# Altium schematic sheet VEHICLE_RAW_SCH.SchDoc
size A4; SheetNumber: 2; SheetTotal: 3
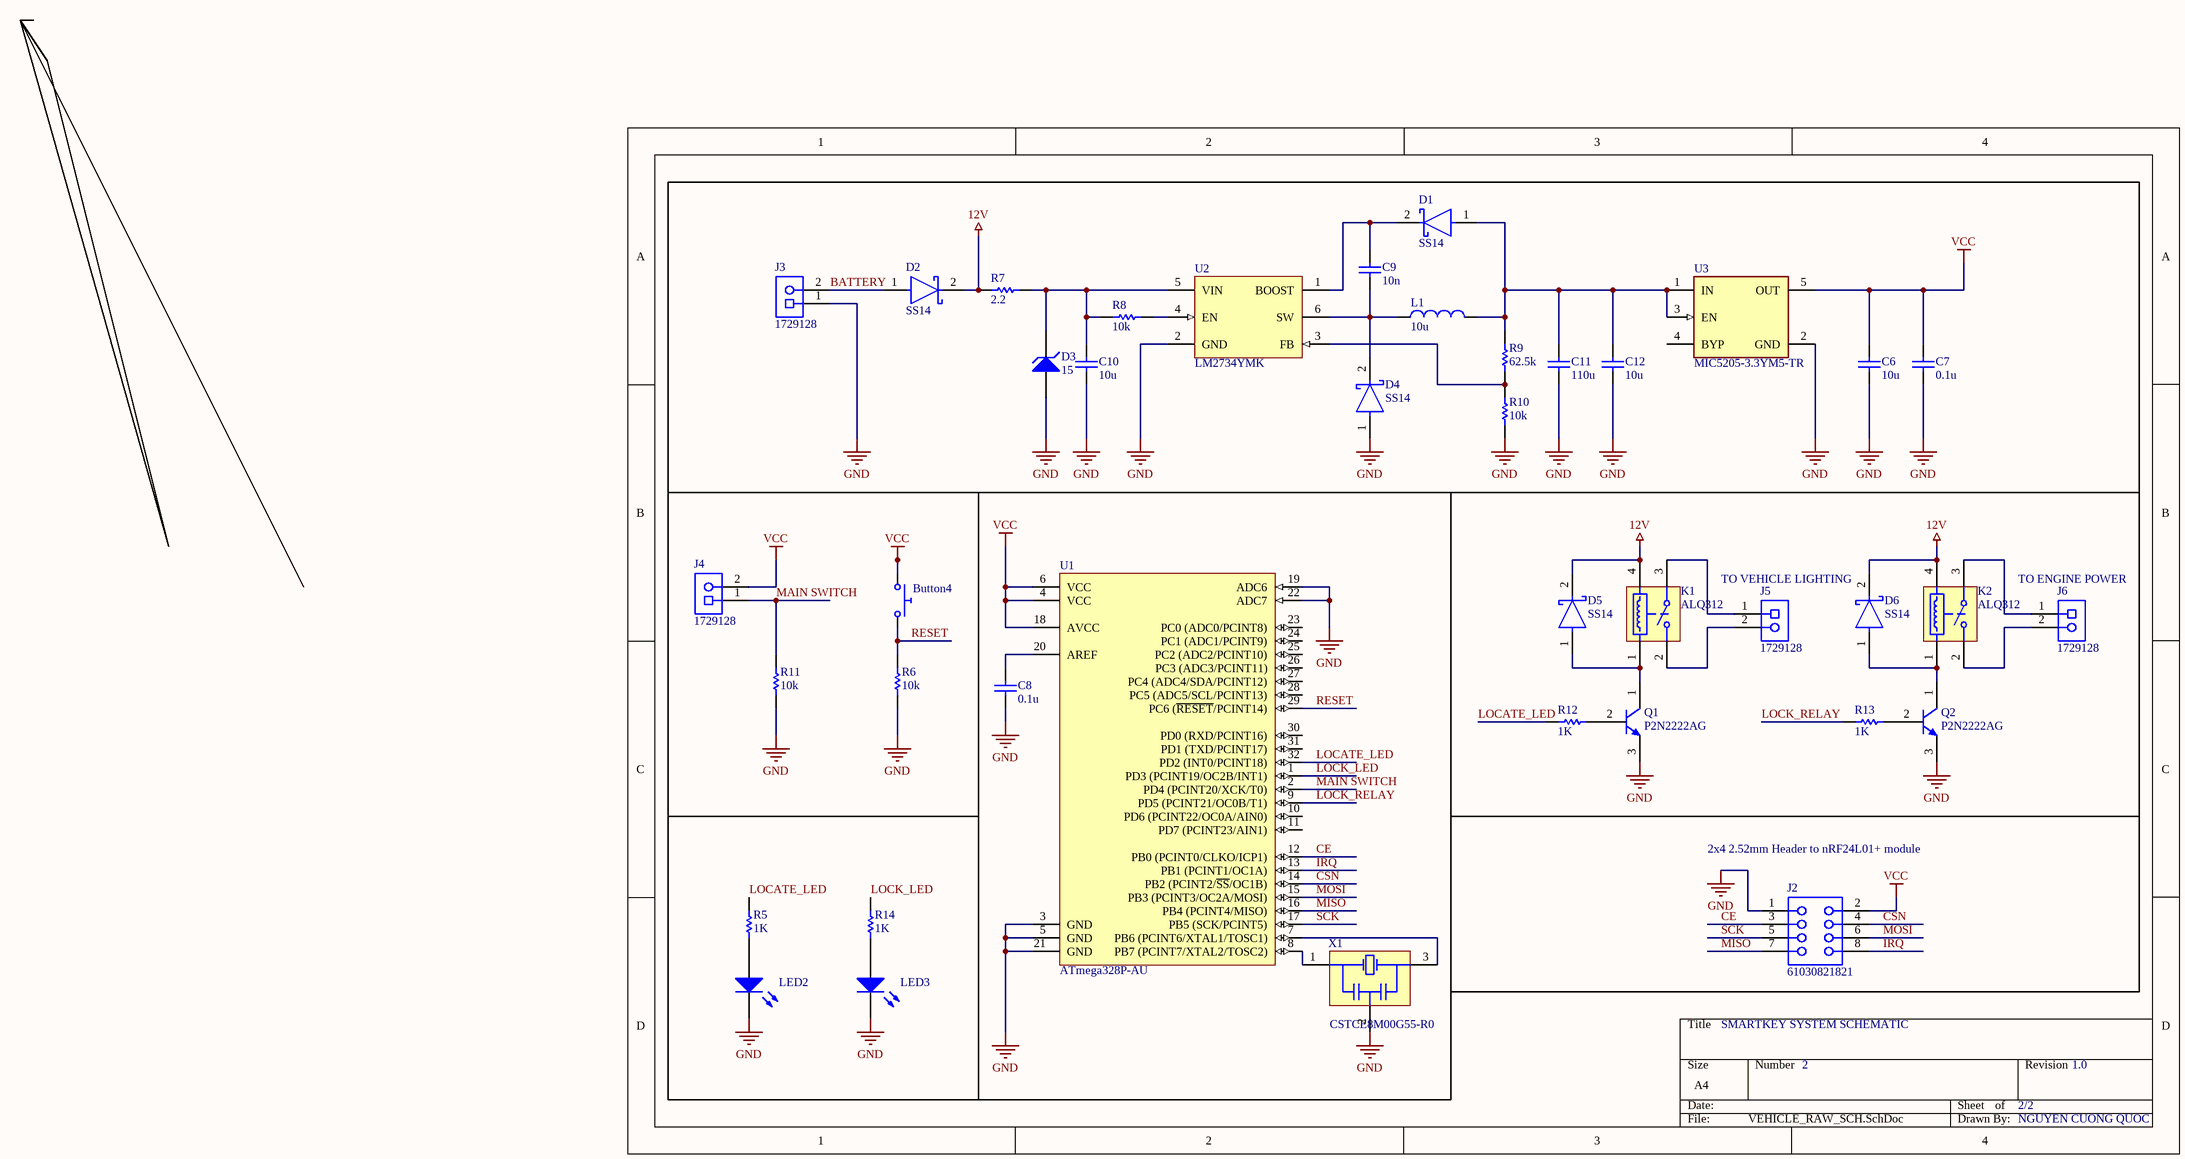
[diagram p0: VEHICLE_RAW_SCH.SchDoc]

## Parts
Button4  Push Button Normally Opened  (value not drawn)
C6  value 10u  (hidden comment: Capacitor)
C7  value 0.1u  (hidden comment: Capacitor)
C8  value 0.1u  (hidden comment: Capacitor)
C9  value 10n  (hidden comment: Capacitor)
C10  value 10u  (hidden comment: Capacitor)
C11  value 110u  (hidden comment: Capacitor)
C12  value 10u  (hidden comment: Capacitor)
D1  SS14  [FP-403AE-MFG]
D2  SS14  [FP-403AE-MFG]
D3  BV: 15  (hidden comment: Zener Diode)
D4  SS14  [FP-403AE-MFG]
D5  SS14  [FP-403AE-MFG]
D6  SS14  [FP-403AE-MFG]
J2  61030821821  [61030821821]
J3  1729128  [PHOE-1729128-2_V]
J4  1729128  [PHOE-1729128-2_V]
J5  1729128  [PHOE-1729128-2_V]
J6  1729128  [PHOE-1729128-2_V]
K1  ALQ312  [PNSC-LQ-4-2000x1000x1600_V]
K2  ALQ312  [PNSC-LQ-4-2000x1000x1600_V]
L1  value 10u  (hidden comment: Inductor)
LED2  Light-Emitting Diode  (value not drawn)
LED3  Light-Emitting Diode  (value not drawn)
Q1  P2N2222AG  [ONSC-TO-92-3-29-11]
Q2  P2N2222AG  [ONSC-TO-92-3-29-11]
R5  value 1K  (hidden comment: Resistor)
R6  value 10k  (hidden comment: Resistor)
R7  value 2.2  (hidden comment: Resistor)
R8  value 10k  (hidden comment: Resistor)
R9  value 62.5k  (hidden comment: Resistor)
R10  value 10k  (hidden comment: Resistor)
R11  value 10k  (hidden comment: Resistor)
R12  value 1K  (hidden comment: Resistor)
R13  value 1K  (hidden comment: Resistor)
R14  value 1K  (hidden comment: Resistor)
U1  ATmega328P-AU  [32A_M]
U2  LM2734YMK  [DDC0006A_M]
U3  MIC5205-3.3YM5-TR  [FP-M5-MFG]
X1  CSTCE8M00G55-R0  [MURA-CSTCE_G_A-3_V]

## Nets
12V: D2.2(C) D5.2(C) D6.2(C) K1.4 K2.4 R7.2
GND: C6.1 C7.1 C8.1 C10.1 C11.1 C12.1 D3.1(A) D4.1(A) J2.1 J3.1 LED2.2(K) LED3.2(K) Q1.3(E) Q2.3(E) R6.1 R10.2 R11.1 U1.3(GND) U1.5(GND) U1.19(ADC6) U1.21(GND) U1.22(ADC7) U2.2(GND) U3.2(GND) X1.2(GND)
VCC: Button4.1 C6.2 C7.2 J2.2 J4.2 U1.4(VCC) U1.6(VCC) U1.18(AVCC) U3.5(OUT)
BATTERY: D2.1(A) J3.2
CE: J2.3 U1.12(PB0_(PCINT0/CLKO/ICP1))
CSN: J2.4 U1.14(PB2_(PCINT2/~{SS}/OC1B))
IRQ: J2.8 U1.13(PB1_(PCINT1/OC1A))
LOCATE_LED: R5.2 R12.2 U1.32(PD2_(INT0/PCINT18))
LOCK_LED: R14.2 U1.1(PD3_(PCINT19/OC2B/INT1))
LOCK_RELAY: R13.2 U1.9(PD5_(PCINT21/OC0B/T1))
MAIN SWITCH: J4.1 R11.2 U1.2(PD4_(PCINT20/XCK/T0))
MISO: J2.7 U1.16(PB4_(PCINT4/MISO))
MOSI: J2.6 U1.15(PB3_(PCINT3/OC2A/MOSI))
RESET: Button4.2 R6.2 U1.29(PC6_(~{RESET}/PCINT14))
SCK: J2.5 U1.17(PB5_(SCK/PCINT5))
NetC8_2: C8.2 U1.20(AREF)
NetC9_1: C9.1 D4.2(C) L1.1 U2.6(SW)
NetC9_2: C9.2 D1.2(C) U2.1(BOOST)
NetC10_2: C10.2 D3.2(K) R7.1 R8.2 U2.5(VIN)
NetC11_2: C11.2 C12.2 D1.1(A) L1.2 R9.1 U3.1(IN) U3.3(EN)
NetD5_1: D5.1(A) K1.1 Q1.1(C)
NetD6_1: D6.1(A) K2.1 Q2.1(C)
NetJ5_1: J5.1 K1.3(COM)
NetJ5_2: J5.2 K1.2(NO)
NetJ6_1: J6.1 K2.3(COM)
NetJ6_2: J6.2 K2.2(NO)
NetLED2_1: LED2.1(A) R5.1
NetLED3_1: LED3.1(A) R14.1
NetQ1_2: Q1.2(B) R12.1
NetQ2_2: Q2.2(B) R13.1
NetR8_1: R8.1 U2.4(EN)
NetR9_2: R9.2 R10.1 U2.3(FB)
NetU1_7: U1.7(PB6_(PCINT6/XTAL1/TOSC1)) X1.3(X2)
NetU1_8: U1.8(PB7_(PCINT7/XTAL2/TOSC2)) X1.1(X1)

Not connected (* = marked no-connect by the designer): U1 10(PD6_(PCINT22/OC0A/AIN0)) 11(PD7_(PCINT23/AIN1)) 23(PC0_(ADC0/PCINT8)) 24(PC1_(ADC1/PCINT9)) 25(PC2_(ADC2/PCINT10)) 26(PC3_(ADC3/PCINT11)) 27(PC4_(ADC4/SDA/PCINT12)) 28(PC5_(ADC5/SCL/PCINT13)) 30(PD0_(RXD/PCINT16)) 31(PD1_(TXD/PCINT17)); U3 4(BYP)

## Notes on the sheet
- TO VEHICLE LIGHTING
- (near J6) TO ENGINE POWER
- 2x4 2.52mm Header to nRF24L01+ module
- SMARTKEY SYSTEM SCHEMATIC
- 2
- 2/2
- 1.0
- NGUYEN CUONG QUOC

## Library data of the parts
Button4 = Push Button NO: closed: 0; Rclosed: 1m; Ropen: 1Meg; SimulationGenericComponent: True
C6-C12 = Capacitor: SimulationGenericComponent: True
D1 D2 D4-D6 = CMP-2000-04943-2: DIODE SCHOTTKY 40V 1A SMA; Manufacturer: ON Semiconductor; Peak Reverse Current: 0.2mA; Max Junction Temp: +125°C; Standoff Height: 0.05mm; Max Surge Forward Current: 40A; Mouser Description: Schottky Diodes & Rectifiers SMA 40V 1.0A; RoHS: TRUE; Lead Free: Yes; Manufacturer Part Number: SS14; Device Class L3: Schottky Diodes; Category: Diode; Automotive: No; Digikey Description: DIODE SCHOTTKY 40V 1A SMA; ComponentLink2Description: Datasheet; Device Class L2: Diodes; Height: 2.5mm; Temperature Range High: +125°C; ComponentLink2URL: https://www.onsemi.com/pub/Collateral/SS19-D.PDF; Device Class L1: Discrete Semiconductors; Package: 403AE; Octopart: https://octopart.com/ss14-on+semiconductor-29205033; Max Repetitive Reverse Voltage: 40V; Temperature Range Low: -65°C; Forward Current: 1A; Temperature: -65°C to +125°C
D3 = Zener Diode: AF: 1; BV_MAX: 1e99; CJO: 0; EG: 1.11; FC: 0.5; IBV: 0.001; IS: 1e-14; MJSW: 0.33; NTUN: 30; TNOM: 27; XTI: 3; SimulationGenericComponent: True; CJP: 0; CTA: 0; CTP: 0; FCS: 0.5; FV_MAX: 1e99; IKF: 0; IKR: 0; ISR: 1e-14; JSW: 0; JTUN: 0; JTUNSW: 0; KEG: 1; KF: 0; LEVEL: 1; N: 1; NBV: 1; NR: 1; NS: 1; PHP: 1; RS: 0; TCV: 0; TLEV: 0; TLEVC: 0; TM1: 0; TM2: 0; TPB: 0; TPHP: 0; TRS: 0; TRS2: 0; TT: 0; TTT1: 0; TTT2: 0; VJ: 1; XTITUN: 3
J2 = CMP-1502-01304-3: NexarPartId: 89205501; Gender: Female; Current Rating: 3A; Operating Supply Voltage: 250V; Contact Resistance: 20mΩ; Orientation: Vertical; RoHS: Non-Compliant; Number of Pins: 8; Packaging: Tape and Reel; Lead Pitch: 2.54mm
J3-J6 = CMP-2000-05815-1: PCB Terminal Block, 13.5 A, 400 V, 2-Pin THD, RoHS, Bulk; Manufacturer: Phoenix Contact; Package Version: 03/2015; No. of Rows: 1; Pitch: 5.08mm; No. of Positions: 2; Voltage Rating: 400V; Current Rating: 13500mA; Manufacturer URL: http://www.phoenixcontact.com/; Datasheet URL: https://datasheet.ciiva.com/16046/1729128-16046181.pdf; RoHS: TRUE; Package URL: https://www.phoenixcontact.com/online/portal/pi/pxc/product_detail_page/!ut/p/b1/3VdJjqNKFDxLH8AFycySyWY2ozFsEPOMMQaDOX1XedGL_1Vdm5YXJleknhSKeBkvI6EA8ncAo3AYoDhBQGco6KN7VURTdemj9us_IEKEZo_YHiPAEWEFmDGOHMORkqKYCORBZxgL7ZoaZYcbFFUZ3fqxSY6GOuxydWUuHqz1ynmMFygu583Bob0Ewr6Sd_l-5m-kAueHiB0jpRwZwe58wwtkpxtMYd_LmGcDRU02dRNEyWt6Y2ti5pSyJ_reIkzIulrqApdnbT11V5jnCKbYNCvhEM1MCpPByat_X379-iThf08CI5GfOPqfBeS3BRoBOdD55AKVv0iLwCMq-2BrzXWSGRH7pUGD9uwXQjiph3xL0DKQwdGa0JImiIOmBNOestqgwTHSSs2oOep-78apyXQBvNi8ZLaFjvjWvcaUEBu0MC6Wbe-d6mB0FAebo2lUWinqYaZs5DAYzV0RP9yitUjnGJ0iI9xhZkT42OCQNUJJhkgWINNQLP2JFP6OpMg3JCVg70jqHT0lvKOnhHf0lPuOnnLf0VPuWx6_dxwUIvwk5WMkT0kLL1mh61l2yZVSzG3pYV_bqo-mj6uMKwKwdnnW8Jh5RTOJzMOA5c-eJDaZQw4mTMPH02PvS_ZAqNVjVTo2WyYLkwH_KU1mmmG5kjRhDqPXLwwVHvVOjCM60-fpXvTDfMGW1PVFVS1r4e4yVDk4ZdNbkUHvqPqQSeian4UD39fNKmachqdJ1NJbyk8rXT9mXTvPk3oE5meulKGgiruPJek-4I9hTT6G8ZLOyRSm2RRVbThERQad5OS28hdt4YW4vG0stgYYzsWsK4_7y6DZMjJSCqri1kyiZR5vD7pwIrNR7QwPHTcLTI5qT7eRlpHrdGiupYlqQDJ7zy_CND8fWWBoLRXxk1RVcXiBQwbTD4Xi7KL-FuO94t9xaqweXzH; PartNumber: 1729128; Package Description: 2-Pin Through Hole Device, Body 8.1 x 10.16 mm, Pitch 5.08 mm; Datasheet Version: 12/2013; Mounting Technology: ThroughHole; Orientation: Horizontal; Package Reference: 1729128-2; Packing: Bulk
K1 K2 = CMP-1503-00190-1: LQ Relays, 12 V Coil Voltage, 200 mW Nominal Operating Power, -40 to 85 degC, 4-Pin LQ, Carton, Case, RoHS; Manufacturer: Panasonic; Pb-Free: True; Nominal Operating Power: 200 mW; Max Switching Current: 10 A (N.O.), 3 A (N.C.); Electrical Life: 5x10^4; Coil Voltage: 12 V; Mechanical Life(Min.operation): 1x10^7; Max Switching Voltage: 250 V AC; Mounting Technology: Through Hole; ComponentLink3URL: http://www3.panasonic.biz/ac/e_download/control/relay/power/catalog/mech_eng_lq.pdf?f_cd=401220; Series: LQ Relays; Packing: Carton, Case; RoHS: True; PackageVersion: ASCTB92E, 10/2014; ComponentLink1URL: http://www3.panasonic.biz/ac/ae/index.jsp; PartNumber: ALQ312; PackageReference: LQ-4-2000x1000x1600; PackageDescription: 4-Pin Through Hole Terminal Package, Body 20 x 10 mm; ComponentLink2URL: http://www3.panasonic.biz/ac/e_download/control/relay/power/catalog/mech_eng_lq.pdf?f_cd=401220; ComponentLink3Description: Package Specification; ComponentLink2Description: Datasheet; ComponentLink1Description: Manufacturer URL; DatasheetVersion: 201410-T
L1 = Inductor: SimulationGenericComponent: True
LED2 LED3 = LED: AF: 1; BV: 0; BV_MAX: 1e99; EG: 1.11; FC: 0.5; IBV: 0.001; IS: 1e-14; MJSW: 0.33; NTUN: 30; TNOM: 27; XTI: 3; SimulationGenericComponent: True; CJO: 0; CJP: 0; CTA: 0; CTP: 0; FCS: 0.5; FV_MAX: 1e99; IKF: 0; IKR: 0; ISR: 1e-14; JSW: 0; JTUN: 0; JTUNSW: 0; KEG: 1; KF: 0; LEVEL: 1; N: 1; NBV: 1; NR: 1; NS: 1; PHP: 1; RS: 0; TCV: 0; TLEV: 0; TLEVC: 0; TM1: 0; TM2: 0; TPB: 0; TPHP: 0; TRS: 0; TRS2: 0; TT: 0; TTT1: 0; TTT2: 0; VJ: 1; XTITUN: 3
Q1 Q2 = CMP-1048-01402-1: Amplifier Transistor, NPN Silicon, 3-Pin TO-92, Pb-Free, Bulk Box; Manufacturer: On Semiconductor; IC Continuous (A): 0.6; fT Min (MHz): 300; ComponentLink2Description: Datasheet; ComponentLink1Description: Manufacturer URL; ComponentLink2URL: http://www.onsemi.com/pub_link/Collateral/P2N2222A-D.PDF; ComponentLink3Description: Package Specification; RoHS: TRUE; ComponentLink1URL: http://www.onsemi.com/; PartNumber: P2N2222AG; Mounting Technology: Through Hole; PackageReference: TO-92-3-29-11_AM_SL; Polarity: NPN; Packing: Bulk Box; DatasheetVersion: Rev. 7; PackageDescription: 3-Pin Transistor Outline, Body 4.825 x 3.685 mm, Pitch 1.27 mm; PackageVersion: Rev. AM; ComponentLink3URL: http://www.onsemi.cn/pub_link/Collateral/2N6426-D.PDF
R5-R14 = Resistor: TC1: 0; SimulationGenericComponent: True; TC2: 0
U1 = CMP-0095-00269-2: 8-bit AVR Microcontroller, 32KB Flash, 1KB EEPROM, 2KB SRAM, 32-pin TQFP, Industrial Grade (-40°C to 85°C); PackageDescription: 32-Lead, 7x7x1.0 mm Body, 0.8mm Lead Pitch, Thin Profile Plastic Quad Flat Package (TQFP); DatasheetVersion: revD, May-2011; RevisionNote: DatasheetVersion & PackageVersion updated. URLs added.; ComponentLink1URL: http://www.atmel.com/; ComponentLink2Description: ATmega48A/48PA/88A/88PA/168A/168PA/328/328P Datasheet; Code_JEDEC: MS-026-ABA; ComponentLink1Description: Manufacturer URL; PackageReference: 32A; ComponentLink3Description: ATmega48A/48PA/88A/88PA/168A/168PA/328/328P Summary; ComponentLink2URL: http://www.atmel.com/dyn/resources/prod_documents/doc8271.pdf; PackageVersion: revC, Oct-2010; ComponentLink3URL: http://www.atmel.com/dyn/resources/prod_documents/8271S.pdf
U2 = CMP-0069-01204-3: 1A Load Step-Down DC-DC Regulator, 6-pin Tiny SOT23; Manufacturer: Texas Instruments; PackageTopMarking: SFEB*XTT; PowerWise: N; CompType: Switcher; PinCount: 6; Code_JEDEC: MO-193-AA; PackageDescription: Molded TSOT, 2.97 x 1.65 x 0.87mm Body, 6 Lead, 0.95mm Pitch; PackageReference: DDC0006A; Code_IPC: SOT26A-6; RoHS: N; ComponentLink1URL: http://www.ti.com/general/docs/lit/getliterature.tsp?genericPartNumber=LM2734&fileType=pdf; ComponentLink1Description: Datasheet URL
U3 = CMP-06324-000014-1: IC REG LINEAR 3.3V 150MA SOT23-5; Manufacturer: Microchip; Number Of Outputs: 1; Output Type: Fixed; Min Supply Voltage: 2.5V; Accuracy Percentage: 2%; Dropout Voltage: 165mV; Max Supply Voltage: 16V; Max Junction Temp: +125°C; Standoff Height: 0mm; Digikey Description: IC REG LINEAR 3.3V 150MA SOT23-5; Output Current: 150mA; Temperature: -40°C to +125°C; Temperature Range High: +125°C; Height: 1.45mm; ComponentLink2URL: http://ww1.microchip.com/downloads/en/DeviceDoc/20005785A.pdf; Mouser Description: LDO Voltage Regulators; Device Class L3: Voltage Regulators - Linear; Package: M5; Temperature Range Low: -40°C; Device Class L1: Integrated Circuits (ICs); ComponentLink2Description: Datasheet; Automotive: No; Ipc Land Pattern Name: SOT95P280X118-5; Octopart: https://octopart.com/mic5205-3.3ym5-tr-microchip-66802130; Device Class L2: Power Management ICs; Manufacturer Part Number: MIC5205-3.3YM5-TR; Lead Free: Yes; RoHS: TRUE
X1 = CMP-2100-03620-1: Ceramic Resonator, 8 MHz, +/- 0.5%, -20 to 80 degC, 3-Pin SMD, RoHS, Tape and Reel; Manufacturer: Murata; Capacitance: 33pF; Frequency Stability: 0.2%; Self Resonant Frequency: 8MHz; Datasheet Version: 42339.0; RoHSCompliant: True; Datasheet URL: http://www.murata.com/~/media/webrenewal/support/library/catalog/products/timingdevice/ceralock/p16e.ashx; Case/Package: Ceramic; Load Capacitance: 33pF; Tolerance: 0.5%; Mount: SurfaceMount; Height: 0.031inch; Number of Pins: 3; Package Description: 3-Pin Surface Mount Device, Body 3.2 x 1.3 mm, Pitch 1.2 mm; Package Quantity: 1; Lead Free: LeadFree; Contact Plating: Gold; REACH SVHC: NoSVHC; Length: 0.126inch; Width: 0.051inch; Manufacturer URL: http://www.murata.com/; Packaging: TapeandReel; Termination: SMD/SMT; Frequency Tolerance: 0.5%; Max Operating Temperature: 80degC; Composition: Ceramic; Package Reference: CSTCE_G_A-3; Min Operating Temperature: -20degC; Frequency: 8MHz